# EAGLE schematic schema evaluatie week 5 (EAGLE 9.5.2)
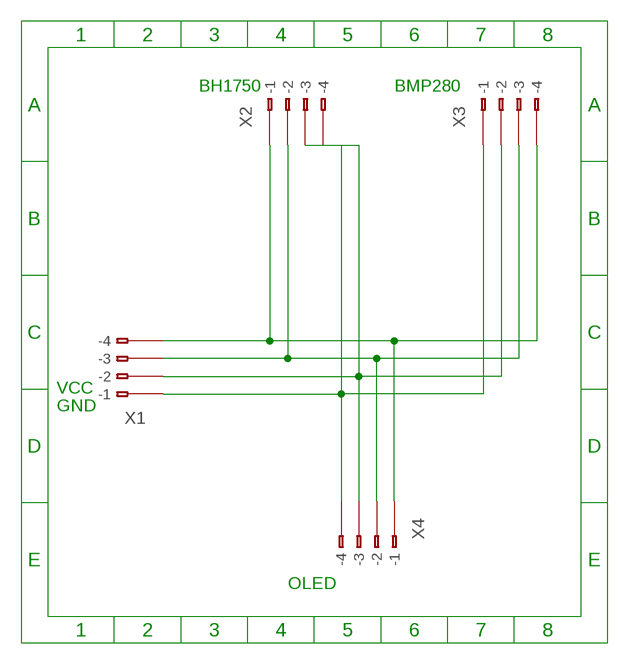
[diagram p0: schematic, sheet 1]

## Parts
X1  233-104  [233-104]
X2  233-104  [233-104]
X3  233-104  [233-104]
X4  233-104  [233-104]

## Nets
N$1: X1.B1(B-1) X2.B3(B-3) X3.B1(B-1) X4.B4(B-4)
N$2: X1.B2(B-2) X2.B4(B-4) X3.B2(B-2) X4.B3(B-3)
N$5: X1.B3(B-3) X2.B2(B-2) X3.B3(B-3) X4.B2(B-2)
N$6: X1.B4(B-4) X2.B1(B-1) X3.B4(B-4) X4.B1(B-1)
Unconnected: X1.A1(-1) X1.A2(-2) X1.A3(-3) X1.A4(-4) X2.A1(-1) X2.A2(-2) X2.A3(-3) X2.A4(-4) X3.A1(-1) X3.A2(-2) X3.A3(-3) X3.A4(-4) X4.A1(-1) X4.A2(-2) X4.A3(-3) X4.A4(-4)

## Notes on the sheet
- BH1750 | BMP280
- VCC
- GND
- OLED

## Library data of the parts
X1-X4 = con-wago:233-104: WAGO Cage Clamp; MPN: 233-104; OC_FARNELL: unknown; OC_NEWARK: 28K9046